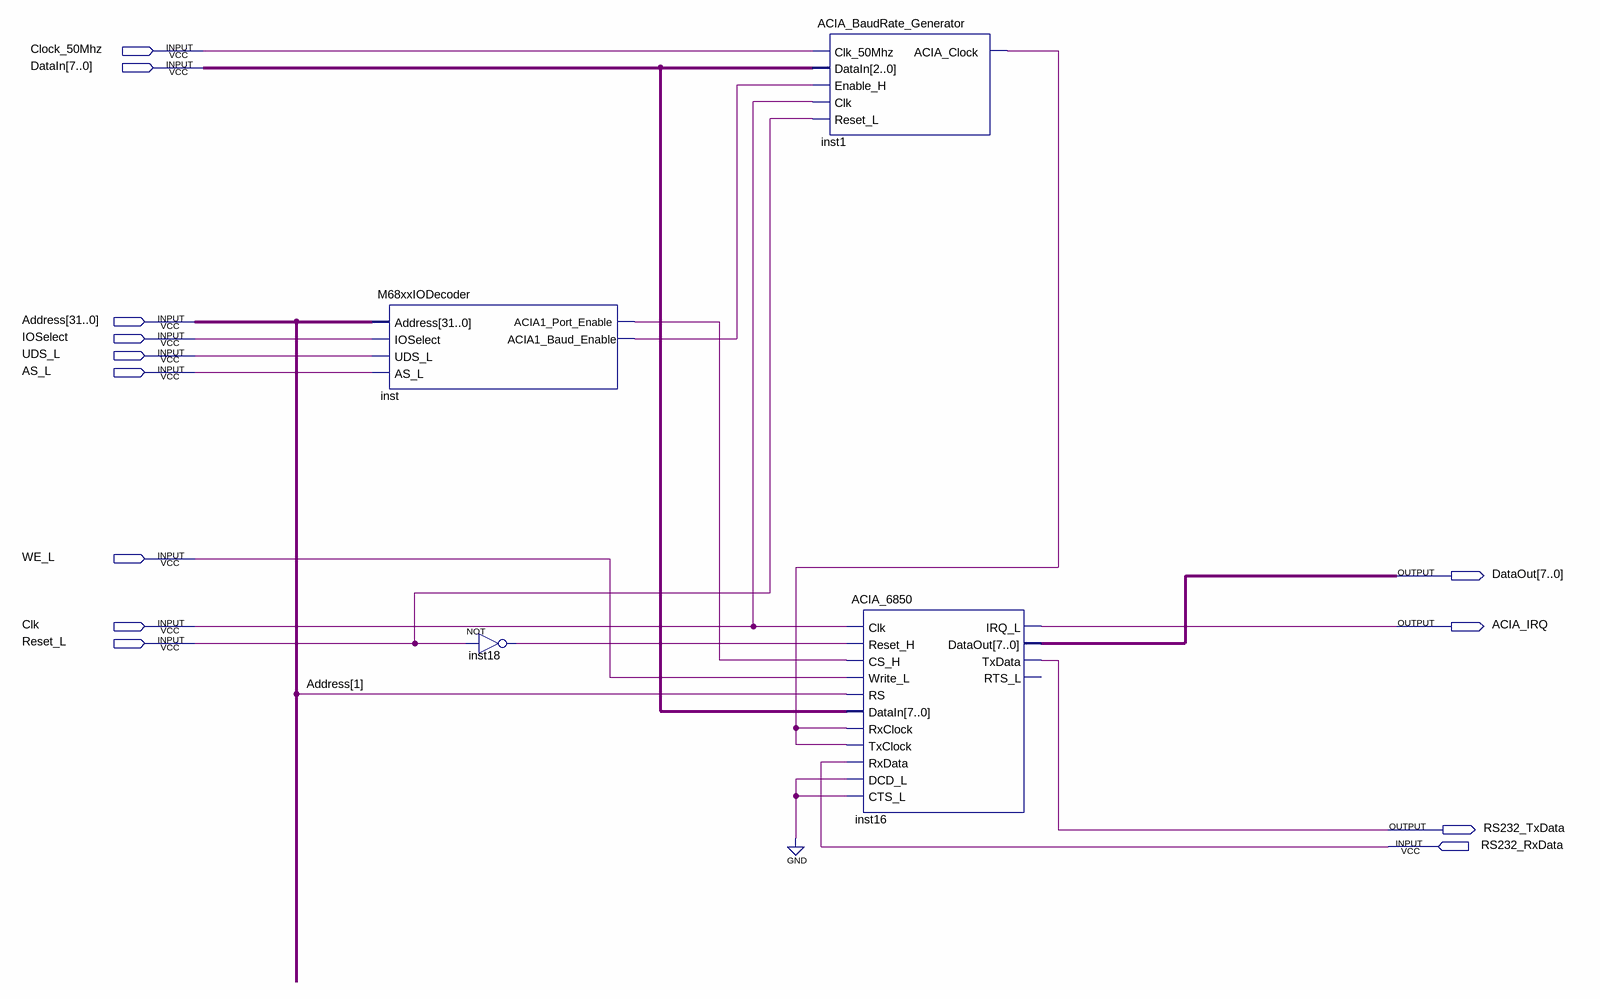
[diagram p0: schematic sheet]
// Quartus schematic OnChipM68xxIO.bdf as structural Verilog: 4 symbols, 13 pins
module OnChipM68xxIO (
  input  Clock_50Mhz,
  input  [7:0] DataIn,
  input  [31:0] Address,
  input  IOSelect,
  input  UDS_L,
  input  AS_L,
  input  WE_L,
  input  Clk,
  input  Reset_L,
  input  RS232_RxData,
  output [7:0] DataOut,
  output ACIA_IRQ,
  output RS232_TxData
);

  wire inst1_acia_clock, inst18_out, inst_acia1_baud_enable, inst_acia1_port_enable;

  M68xxIODecoder inst (
    .Address(Address), .IOSelect(IOSelect), .UDS_L(UDS_L), .AS_L(AS_L),
    .ACIA1_Port_Enable(inst_acia1_port_enable), .ACIA1_Baud_Enable(inst_acia1_baud_enable));
  not inst18 (inst18_out, Reset_L);
  ACIA_BaudRate_Generator inst1 (
    .Clk_50Mhz(Clock_50Mhz), .DataIn(DataIn[2:0]), .Enable_H(inst_acia1_baud_enable), .Clk(Clk),
    .Reset_L(Reset_L), .ACIA_Clock(inst1_acia_clock));
  ACIA_6850 inst16 (
    .Clk(Clk), .Reset_H(inst18_out), .CS_H(inst_acia1_port_enable), .Write_L(WE_L), .RS(Address[1]),
    .DataIn(DataIn), .RxClock(inst1_acia_clock), .TxClock(inst1_acia_clock), .RxData(RS232_RxData),
    .DCD_L(1'b0), .CTS_L(1'b0), .IRQ_L(ACIA_IRQ), .DataOut(DataOut), .TxData(RS232_TxData));  // open: RTS_L
endmodule
